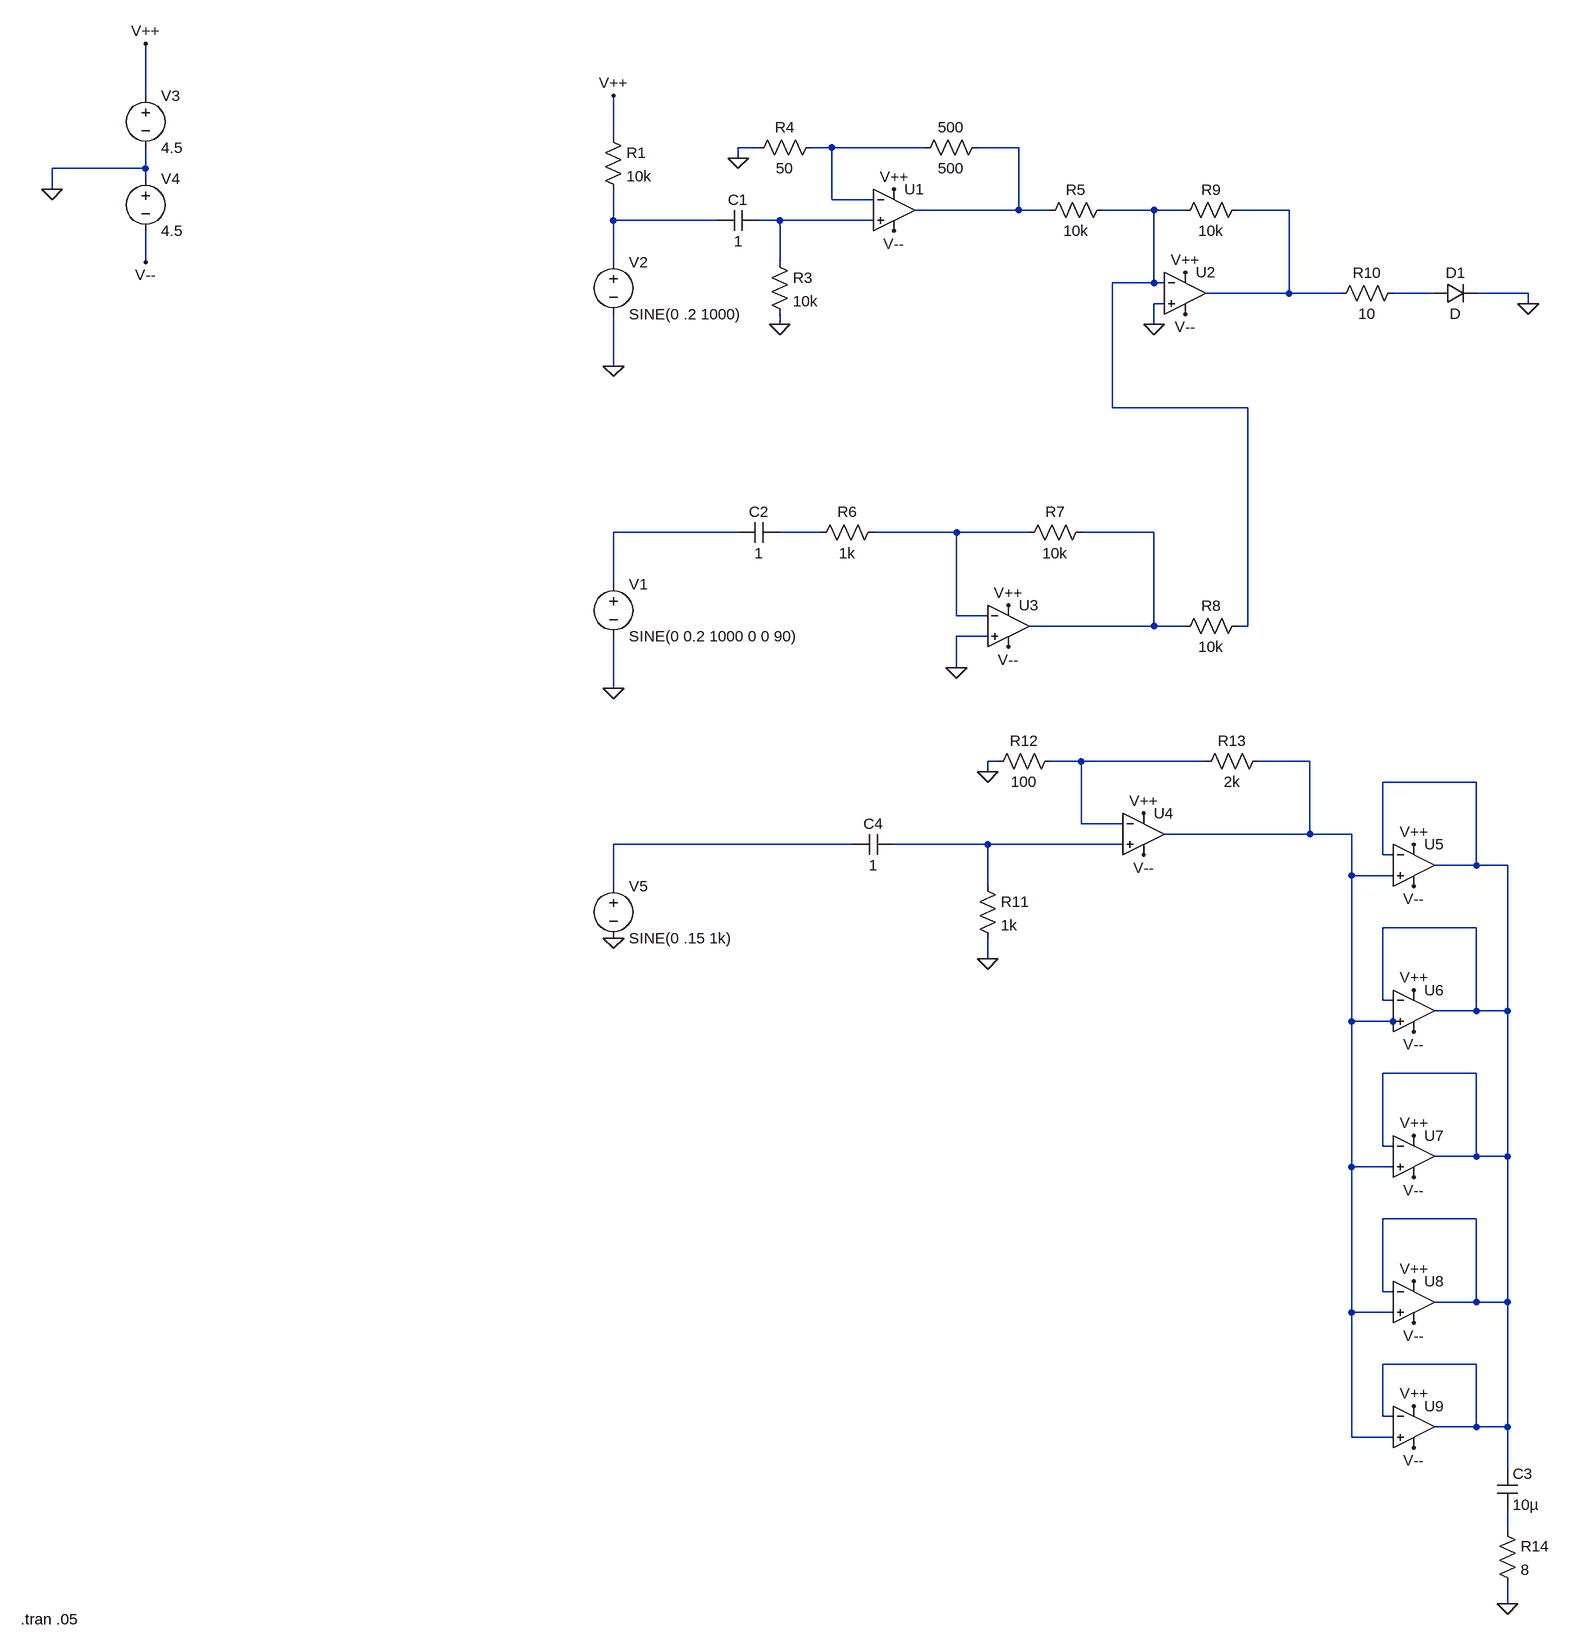
[diagram p0: schematic Project2Schematic.asc]
Project2Schematic.asc, the LTspice schematic file:
Version 4
SHEET 1 1652 2296
WIRE -528 -64 -528 -144
WIRE 192 0 192 -64
WIRE 416 16 384 16
WIRE 528 16 496 16
WIRE 672 16 528 16
WIRE 816 16 752 16
WIRE 384 32 384 16
WIRE -528 48 -528 16
WIRE -528 48 -672 48
WIRE -528 64 -528 48
WIRE -672 80 -672 48
WIRE 528 96 528 16
WIRE 592 96 528 96
WIRE 816 112 816 16
WIRE 816 112 656 112
WIRE 864 112 816 112
WIRE 1024 112 944 112
WIRE 1072 112 1024 112
WIRE 1232 112 1152 112
WIRE 192 128 192 80
WIRE 352 128 192 128
WIRE 448 128 416 128
WIRE 592 128 448 128
WIRE -528 192 -528 144
WIRE 192 192 192 128
WIRE 448 192 448 128
WIRE 1024 224 1024 112
WIRE 1024 224 960 224
WIRE 1040 224 1024 224
WIRE 1232 240 1232 112
WIRE 1232 240 1104 240
WIRE 1312 240 1232 240
WIRE 1456 240 1392 240
WIRE 1600 240 1520 240
WIRE 1040 256 1024 256
WIRE 1600 256 1600 240
WIRE 448 288 448 272
WIRE 1024 288 1024 256
WIRE 192 352 192 272
WIRE 960 416 960 224
WIRE 1168 416 960 416
WIRE 384 608 192 608
WIRE 512 608 448 608
WIRE 720 608 592 608
WIRE 832 608 720 608
WIRE 1024 608 912 608
WIRE 192 688 192 608
WIRE 720 736 720 608
WIRE 768 736 720 736
WIRE 1024 752 1024 608
WIRE 1024 752 832 752
WIRE 1072 752 1024 752
WIRE 1168 752 1168 416
WIRE 1168 752 1152 752
WIRE 768 768 720 768
WIRE 720 816 720 768
WIRE 192 848 192 768
WIRE 784 960 768 960
WIRE 912 960 864 960
WIRE 1104 960 912 960
WIRE 1264 960 1184 960
WIRE 768 976 768 960
WIRE 1520 992 1376 992
WIRE 912 1056 912 960
WIRE 976 1056 912 1056
WIRE 1264 1072 1264 960
WIRE 1264 1072 1040 1072
WIRE 1328 1072 1264 1072
WIRE 560 1088 192 1088
WIRE 768 1088 624 1088
WIRE 976 1088 768 1088
WIRE 1376 1104 1376 992
WIRE 1392 1104 1376 1104
WIRE 1520 1120 1520 992
WIRE 1520 1120 1456 1120
WIRE 1568 1120 1520 1120
WIRE 1328 1136 1328 1072
WIRE 1392 1136 1328 1136
WIRE 192 1152 192 1088
WIRE 768 1152 768 1088
WIRE 1520 1216 1376 1216
WIRE 768 1264 768 1232
WIRE 1376 1328 1376 1216
WIRE 1392 1328 1376 1328
WIRE 1520 1344 1520 1216
WIRE 1520 1344 1456 1344
WIRE 1568 1344 1568 1120
WIRE 1568 1344 1520 1344
WIRE 1328 1360 1328 1136
WIRE 1392 1360 1328 1360
WIRE 1408 1360 1392 1360
WIRE 1520 1440 1376 1440
WIRE 1376 1552 1376 1440
WIRE 1392 1552 1376 1552
WIRE 1520 1568 1520 1440
WIRE 1520 1568 1456 1568
WIRE 1568 1568 1568 1344
WIRE 1568 1568 1520 1568
WIRE 1328 1584 1328 1360
WIRE 1392 1584 1328 1584
WIRE 1520 1664 1376 1664
WIRE 1376 1776 1376 1664
WIRE 1392 1776 1376 1776
WIRE 1520 1792 1520 1664
WIRE 1520 1792 1456 1792
WIRE 1568 1792 1568 1568
WIRE 1568 1792 1520 1792
WIRE 1328 1808 1328 1584
WIRE 1392 1808 1328 1808
WIRE 1520 1888 1376 1888
WIRE 1376 1968 1376 1888
WIRE 1392 1968 1376 1968
WIRE 1520 1984 1520 1888
WIRE 1520 1984 1456 1984
WIRE 1568 1984 1568 1792
WIRE 1568 1984 1520 1984
WIRE 1328 2000 1328 1808
WIRE 1392 2000 1328 2000
WIRE 1568 2048 1568 1984
WIRE 1568 2144 1568 2112
WIRE 1568 2256 1568 2224
FLAG 448 288 0
FLAG -672 80 0
FLAG -528 -144 V++
FLAG -528 192 V--
FLAG 192 352 0
FLAG 384 32 0
FLAG 624 80 V++
FLAG 624 144 V--
FLAG 192 -64 V++
FLAG 1024 288 0
FLAG 1072 208 V++
FLAG 1072 272 V--
FLAG 192 848 0
FLAG 800 720 V++
FLAG 800 784 V--
FLAG 720 816 0
FLAG 768 1264 0
FLAG 1008 1104 V--
FLAG 1008 1040 V++
FLAG 768 976 0
FLAG 1424 1088 V++
FLAG 1424 1152 V--
FLAG 1424 1312 V++
FLAG 1424 1376 V--
FLAG 1424 1536 V++
FLAG 1424 1600 V--
FLAG 1424 1760 V++
FLAG 1424 1824 V--
FLAG 1424 1952 V++
FLAG 1424 2016 V--
FLAG 1568 2256 0
FLAG 192 1232 0
FLAG 1600 256 0
SYMBOL res 176 -16 R0
SYMATTR InstName R1
SYMATTR Value 10k
SYMBOL voltage 192 176 R0
WINDOW 123 0 0 Left 0
WINDOW 39 0 0 Left 0
SYMATTR InstName V2
SYMATTR Value SINE(0 .2 1000)
SYMBOL cap 416 112 R90
WINDOW 0 0 32 VBottom 2
WINDOW 3 32 32 VTop 2
SYMATTR InstName C1
SYMATTR Value 1
SYMBOL res 432 176 R0
SYMATTR InstName R3
SYMATTR Value 10k
SYMBOL voltage -528 -80 R0
SYMATTR InstName V3
SYMATTR Value 4.5
SYMBOL voltage -528 48 R0
SYMATTR InstName V4
SYMATTR Value 4.5
SYMBOL res 768 0 R90
WINDOW 0 0 56 VBottom 2
WINDOW 3 32 56 VTop 2
SYMATTR InstName 500
SYMATTR Value 500
SYMBOL res 512 0 R90
WINDOW 0 0 56 VBottom 2
WINDOW 3 32 56 VTop 2
SYMATTR InstName R4
SYMATTR Value 50
SYMBOL res 960 96 R90
WINDOW 0 0 56 VBottom 2
WINDOW 3 32 56 VTop 2
SYMATTR InstName R5
SYMATTR Value 10k
SYMBOL voltage 192 672 R0
WINDOW 123 0 0 Left 0
WINDOW 39 0 0 Left 0
SYMATTR InstName V1
SYMATTR Value SINE(0 0.2 1000 0 0 90)
SYMBOL cap 448 592 R90
WINDOW 0 0 32 VBottom 2
WINDOW 3 32 32 VTop 2
SYMATTR InstName C2
SYMATTR Value 1
SYMBOL res 608 592 R90
WINDOW 0 0 56 VBottom 2
WINDOW 3 32 56 VTop 2
SYMATTR InstName R6
SYMATTR Value 1k
SYMBOL res 928 592 R90
WINDOW 0 0 56 VBottom 2
WINDOW 3 32 56 VTop 2
SYMATTR InstName R7
SYMATTR Value 10k
SYMBOL res 1168 736 R90
WINDOW 0 0 56 VBottom 2
WINDOW 3 32 56 VTop 2
SYMATTR InstName R8
SYMATTR Value 10k
SYMBOL res 1168 96 R90
WINDOW 0 0 56 VBottom 2
WINDOW 3 32 56 VTop 2
SYMATTR InstName R9
SYMATTR Value 10k
SYMBOL res 1408 224 R90
WINDOW 0 0 56 VBottom 2
WINDOW 3 32 56 VTop 2
SYMATTR InstName R10
SYMATTR Value 10
SYMBOL diode 1456 256 R270
WINDOW 0 32 32 VTop 2
WINDOW 3 0 32 VBottom 2
SYMATTR InstName D1
SYMBOL voltage 192 1136 R0
WINDOW 123 0 0 Left 0
WINDOW 39 0 0 Left 0
SYMATTR InstName V5
SYMATTR Value SINE(0 .15 1k)
SYMBOL cap 624 1072 R90
WINDOW 0 0 32 VBottom 2
WINDOW 3 32 32 VTop 2
SYMATTR InstName C4
SYMATTR Value 1
SYMBOL res 752 1136 R0
SYMATTR InstName R11
SYMATTR Value 1k
SYMBOL res 880 944 R90
WINDOW 0 0 56 VBottom 2
WINDOW 3 32 56 VTop 2
SYMATTR InstName R12
SYMATTR Value 100
SYMBOL res 1200 944 R90
WINDOW 0 0 56 VBottom 2
WINDOW 3 32 56 VTop 2
SYMATTR InstName R13
SYMATTR Value 2k
SYMBOL OpAmps\\UniversalOpAmp2 1424 1120 R0
SYMATTR InstName U5
SYMBOL OpAmps\\UniversalOpAmp2 1424 1344 R0
SYMATTR InstName U6
SYMBOL OpAmps\\UniversalOpAmp2 1424 1568 R0
SYMATTR InstName U7
SYMBOL OpAmps\\UniversalOpAmp2 1424 1792 R0
SYMATTR InstName U8
SYMBOL OpAmps\\UniversalOpAmp2 1424 1984 R0
SYMATTR InstName U9
SYMBOL res 1552 2128 R0
SYMATTR InstName R14
SYMATTR Value 8
SYMBOL OpAmps\\UniversalOpAmp2 624 112 R0
SYMATTR InstName U1
SYMBOL OpAmps\\UniversalOpAmp2 1072 240 R0
SYMATTR InstName U2
SYMBOL OpAmps\\UniversalOpAmp2 800 752 R0
SYMATTR InstName U3
SYMBOL OpAmps\\UniversalOpAmp2 1008 1072 R0
SYMATTR InstName U4
SYMBOL cap 1552 2048 R0
SYMATTR InstName C3
SYMATTR Value 10µ
TEXT -720 2280 Left 2 !.tran .05

The netlist it stands for:
* Project2Schematic.asc
R1 V++ N005 10k
V2 N005 0 SINE(0 .2 1000)
C1 N006 N005 1
R3 N006 0 10k
V3 V++ 0 4.5
V4 0 V-- 4.5
R§500 N002 N001 500
R4 N001 0 50
R5 N003 N002 10k
V1 N008 0 SINE(0 0.2 1000 0 0 90)
C2 N009 N008 1
R6 N010 N009 1k
R7 N011 N010 10k
R8 N003 N011 10k
R9 N004 N003 10k
R10 N007 N004 10
D1 N007 0 D
V5 N015 0 SINE(0 .15 1k)
C4 N016 N015 1
R11 N016 0 1k
R12 N012 0 100
R13 N013 N012 2k
XU5 N013 N014 V++ V-- N014 level2 Avol=1Meg GBW=10Meg Slew=10Meg Ilimit=25m Rail=0 Vos=0 En=0 Enk=0 In=0 Ink=0 Rin=500Meg  ; pins In+ In- V+ V- OUT
XU6 N013 N014 V++ V-- N014 level2 Avol=1Meg GBW=10Meg Slew=10Meg Ilimit=25m Rail=0 Vos=0 En=0 Enk=0 In=0 Ink=0 Rin=500Meg  ; pins In+ In- V+ V- OUT
XU7 N013 N014 V++ V-- N014 level2 Avol=1Meg GBW=10Meg Slew=10Meg Ilimit=25m Rail=0 Vos=0 En=0 Enk=0 In=0 Ink=0 Rin=500Meg  ; pins In+ In- V+ V- OUT
XU8 N013 N014 V++ V-- N014 level2 Avol=1Meg GBW=10Meg Slew=10Meg Ilimit=25m Rail=0 Vos=0 En=0 Enk=0 In=0 Ink=0 Rin=500Meg  ; pins In+ In- V+ V- OUT
XU9 N013 N014 V++ V-- N014 level2 Avol=1Meg GBW=10Meg Slew=10Meg Ilimit=25m Rail=0 Vos=0 En=0 Enk=0 In=0 Ink=0 Rin=500Meg  ; pins In+ In- V+ V- OUT
R14 N017 0 8
XU1 N006 N001 V++ V-- N002 level2 Avol=1Meg GBW=10Meg Slew=10Meg Ilimit=25m Rail=0 Vos=0 En=0 Enk=0 In=0 Ink=0 Rin=500Meg  ; pins In+ In- V+ V- OUT
XU2 0 N003 V++ V-- N004 level2 Avol=1Meg GBW=10Meg Slew=10Meg Ilimit=25m Rail=0 Vos=0 En=0 Enk=0 In=0 Ink=0 Rin=500Meg  ; pins In+ In- V+ V- OUT
XU3 0 N010 V++ V-- N011 level2 Avol=1Meg GBW=10Meg Slew=10Meg Ilimit=25m Rail=0 Vos=0 En=0 Enk=0 In=0 Ink=0 Rin=500Meg  ; pins In+ In- V+ V- OUT
XU4 N016 N012 V++ V-- N013 level2 Avol=1Meg GBW=10Meg Slew=10Meg Ilimit=25m Rail=0 Vos=0 En=0 Enk=0 In=0 Ink=0 Rin=500Meg  ; pins In+ In- V+ V- OUT
C3 N014 N017 10µ
.model D D
.lib standard.dio
.tran .05
.lib UniversalOpAmp2.lib
.backanno
.end